# Altium project A PCB Christmas.PrjPcb
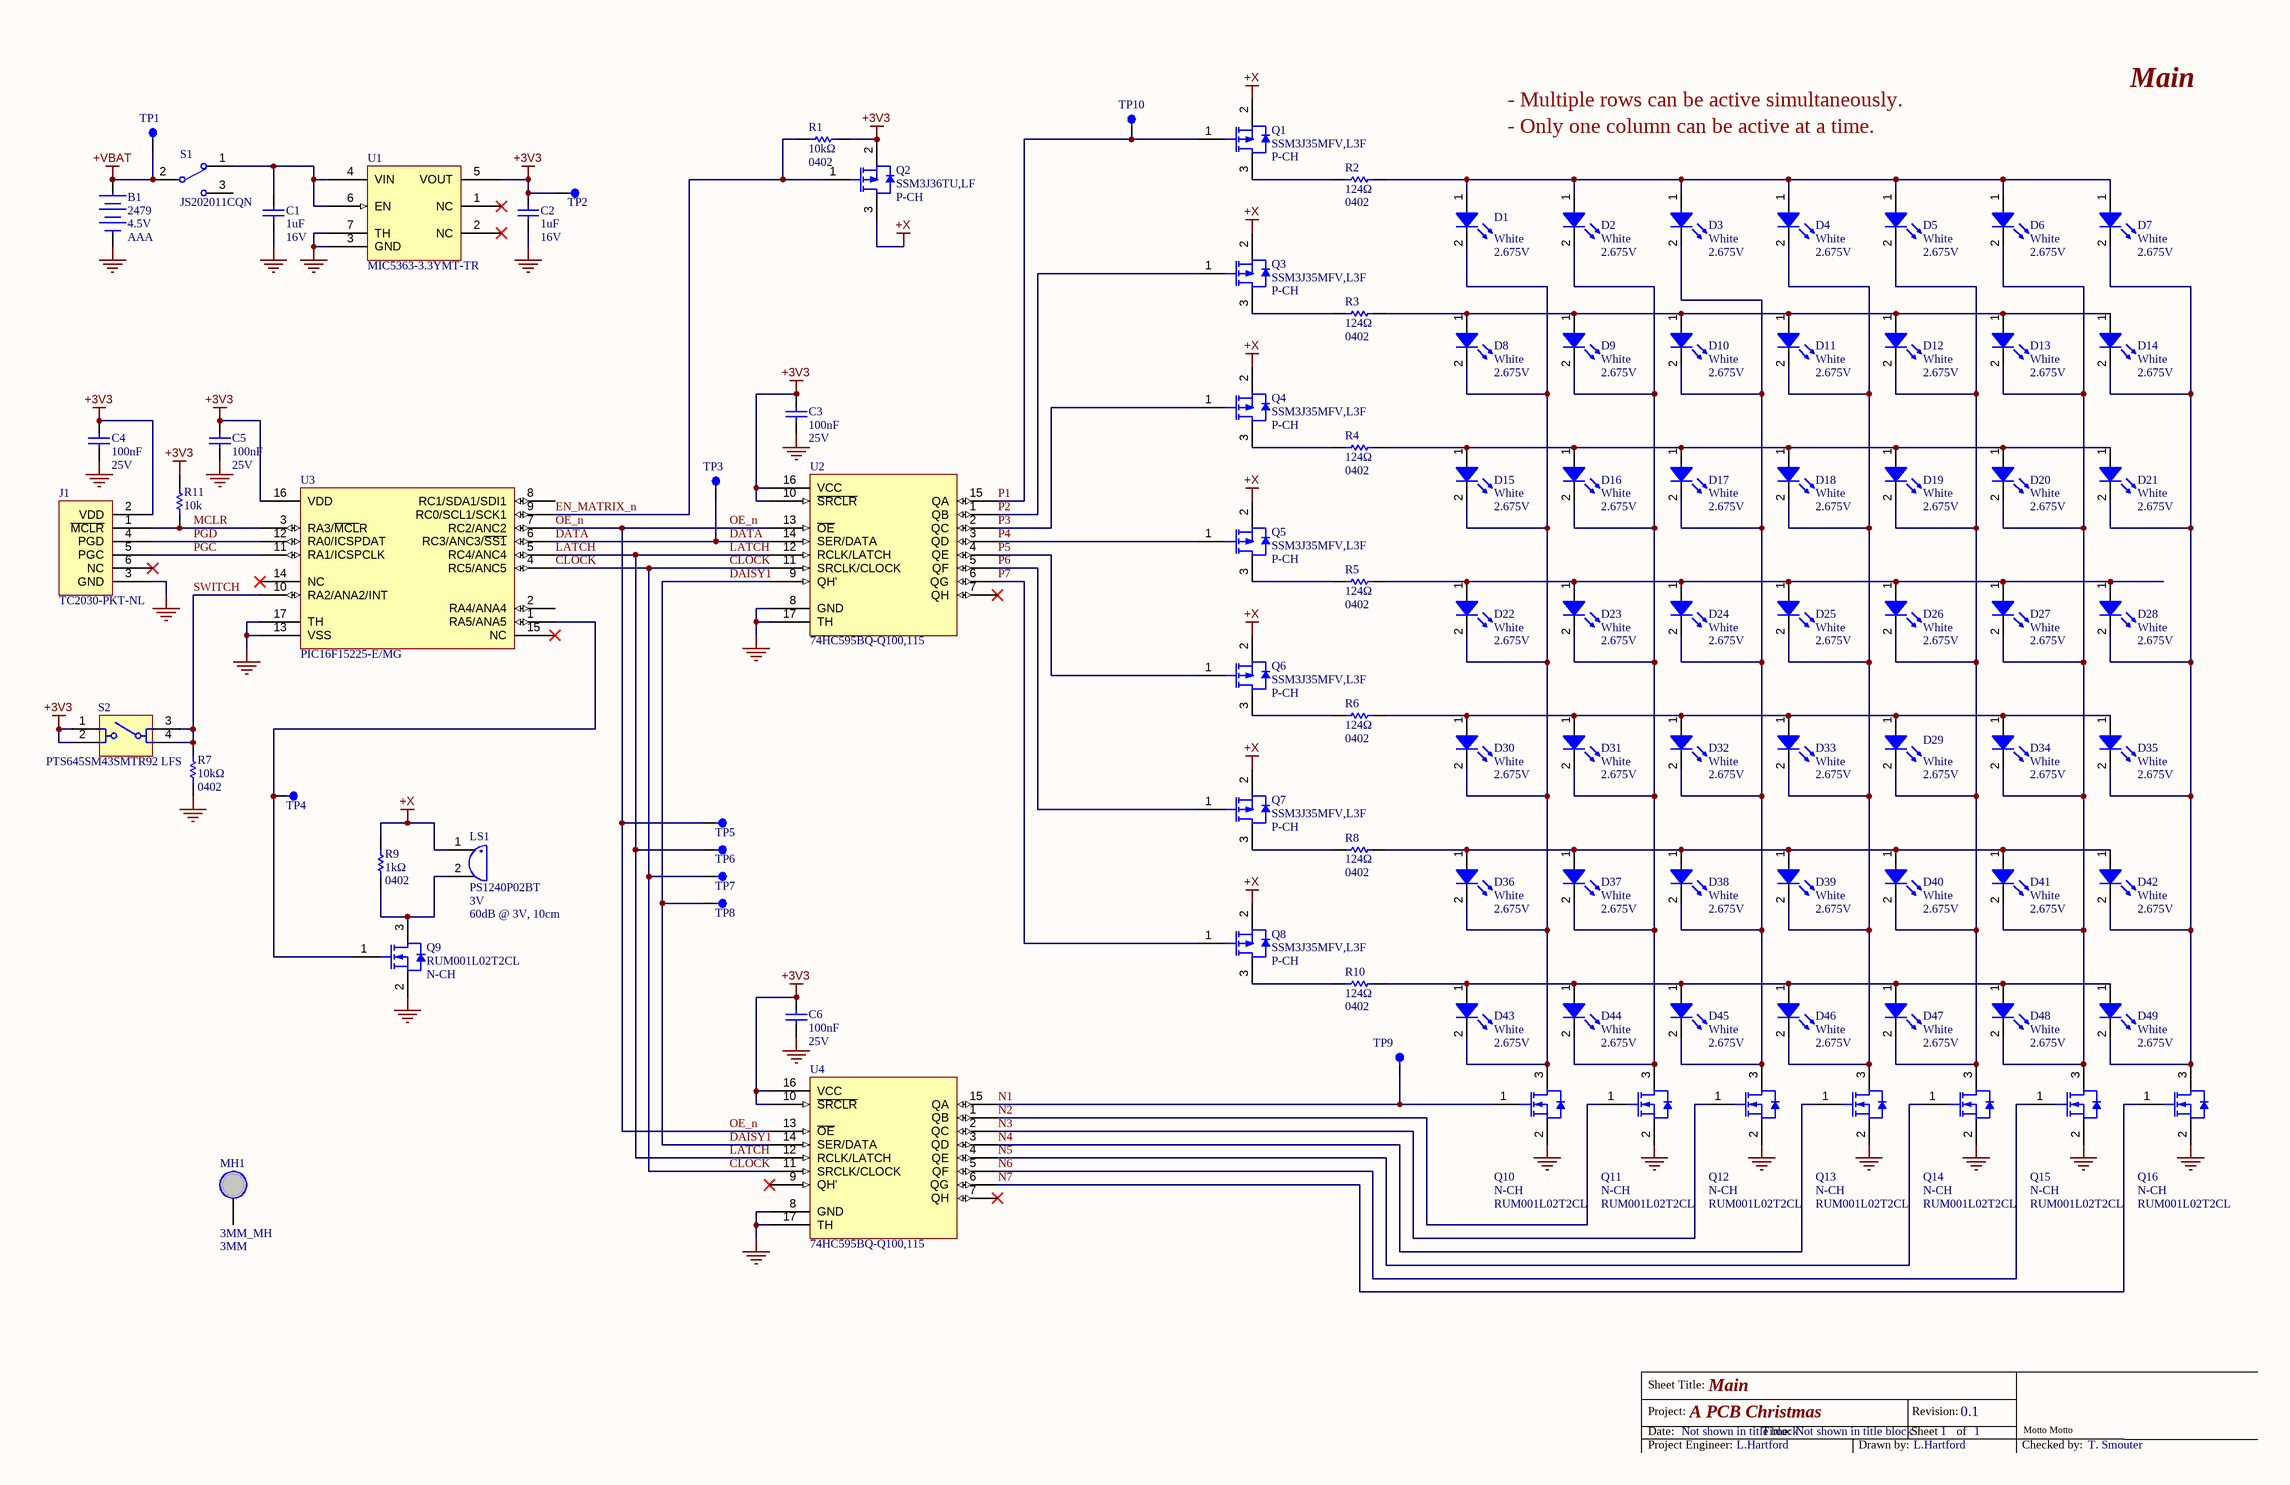
[diagram p0: Main.SchDoc]
EMR_Address: Motto Motto; EMR_Checked_By: T. Smouter; EMR_Copyright_Year: 2021; EMR_Customer: Internal; EMR_Drawn_By: L.Hartford; EMR_Project_Engineer: L.Hartford; EMR_Project_Title: A PCB Christmas; EMR_Revision: 0.1
1 sheet, 102 parts. Net scope: global (net labels, ports and power ports of the same name join across sheets).
Board file: A PCB Christmas.PcbDoc

## Sheet Main.SchDoc: Main
size 431 x 279 mm; Date: Not shown in title block; ApprovedBy: Not shown in title block; CheckedBy: Not shown in title block; Author: Not shown in title block; CompanyName: Not shown in title block; Engineer: Not shown in title block; Organization: EMR Laboratories Inc; Address1: 420 Downsview Pl; Address2: Waterloo, ON; Address3: N2K 3T9; Address4: Canada; Revision: 0.1; PageSetup: Record=PageOptions|CenterHorizontal=True|CenterVertical=True|PrintScale=1.00|XCorrection=1.00|YCorrection=1.00|PrintKind=0|BorderSize=5000000|LeftOffset=0|BottomOffset=0|Orientation=2|PaperLength=1000|PaperWidth=1000|Scale=100|PaperSource=15|PrintQuality=600|MediaType=1|DitherType=10|PaperKind=Letter|PrintScaleMode=1; DocumentNumber: 1; SheetNumber: 1; SheetTotal: 1; CurrentTime: Not shown in title block; CurrentDate: Not shown in title block; Time: Not shown in title block; DocumentFullPathAndName: Not shown in title block; DocumentName: Not shown in title block; ModifiedDate: Not shown in title block; ImagePath: Not shown in title block

### Parts
B1  V: 4.5V  Series: AAA  [2479]  (hidden comment: Three Cell)
C1  value 1uF  Voltage: 16V  [C0402]  (hidden comment: Ceramic Cap)
C2  value 1uF  Voltage: 16V  [C0402]  (hidden comment: Ceramic Cap)
C3  value 100nF  Voltage: 25V  [C0402]  (hidden comment: Ceramic Cap)
C4  value 100nF  Voltage: 25V  [C0402]  (hidden comment: Ceramic Cap)
C5  value 100nF  Voltage: 25V  [C0402]  (hidden comment: Ceramic Cap)
C6  value 100nF  Voltage: 25V  [C0402]  (hidden comment: Ceramic Cap)
D1  Color: White  Forward: 2.675V  [16-219AUTD/S3151/TR8]  (hidden comment: LED)
D2  Color: White  Forward: 2.675V  [16-219AUTD/S3151/TR8]  (hidden comment: LED)
D3  Color: White  Forward: 2.675V  [16-219AUTD/S3151/TR8]  (hidden comment: LED)
D4  Color: White  Forward: 2.675V  [16-219AUTD/S3151/TR8]  (hidden comment: LED)
D5  Color: White  Forward: 2.675V  [16-219AUTD/S3151/TR8]  (hidden comment: LED)
D6  Color: White  Forward: 2.675V  [16-219AUTD/S3151/TR8]  (hidden comment: LED)
D7  Color: White  Forward: 2.675V  [16-219AUTD/S3151/TR8]  (hidden comment: LED)
D8  Color: White  Forward: 2.675V  [16-219AUTD/S3151/TR8]  (hidden comment: LED)
D9  Color: White  Forward: 2.675V  [16-219AUTD/S3151/TR8]  (hidden comment: LED)
D10  Color: White  Forward: 2.675V  [16-219AUTD/S3151/TR8]  (hidden comment: LED)
D11  Color: White  Forward: 2.675V  [16-219AUTD/S3151/TR8]  (hidden comment: LED)
D12  Color: White  Forward: 2.675V  [16-219AUTD/S3151/TR8]  (hidden comment: LED)
D13  Color: White  Forward: 2.675V  [16-219AUTD/S3151/TR8]  (hidden comment: LED)
D14  Color: White  Forward: 2.675V  [16-219AUTD/S3151/TR8]  (hidden comment: LED)
D15  Color: White  Forward: 2.675V  [16-219AUTD/S3151/TR8]  (hidden comment: LED)
D16  Color: White  Forward: 2.675V  [16-219AUTD/S3151/TR8]  (hidden comment: LED)
D17  Color: White  Forward: 2.675V  [16-219AUTD/S3151/TR8]  (hidden comment: LED)
D18  Color: White  Forward: 2.675V  [16-219AUTD/S3151/TR8]  (hidden comment: LED)
D19  Color: White  Forward: 2.675V  [16-219AUTD/S3151/TR8]  (hidden comment: LED)
D20  Color: White  Forward: 2.675V  [16-219AUTD/S3151/TR8]  (hidden comment: LED)
D21  Color: White  Forward: 2.675V  [16-219AUTD/S3151/TR8]  (hidden comment: LED)
D22  Color: White  Forward: 2.675V  [16-219AUTD/S3151/TR8]  (hidden comment: LED)
D23  Color: White  Forward: 2.675V  [16-219AUTD/S3151/TR8]  (hidden comment: LED)
D24  Color: White  Forward: 2.675V  [16-219AUTD/S3151/TR8]  (hidden comment: LED)
D25  Color: White  Forward: 2.675V  [16-219AUTD/S3151/TR8]  (hidden comment: LED)
D26  Color: White  Forward: 2.675V  [16-219AUTD/S3151/TR8]  (hidden comment: LED)
D27  Color: White  Forward: 2.675V  [16-219AUTD/S3151/TR8]  (hidden comment: LED)
D28  Color: White  Forward: 2.675V  [16-219AUTD/S3151/TR8]  (hidden comment: LED)
D29  Color: White  Forward: 2.675V  [16-219AUTD/S3151/TR8]  (hidden comment: LED)
D30  Color: White  Forward: 2.675V  [16-219AUTD/S3151/TR8]  (hidden comment: LED)
D31  Color: White  Forward: 2.675V  [16-219AUTD/S3151/TR8]  (hidden comment: LED)
D32  Color: White  Forward: 2.675V  [16-219AUTD/S3151/TR8]  (hidden comment: LED)
D33  Color: White  Forward: 2.675V  [16-219AUTD/S3151/TR8]  (hidden comment: LED)
D34  Color: White  Forward: 2.675V  [16-219AUTD/S3151/TR8]  (hidden comment: LED)
D35  Color: White  Forward: 2.675V  [16-219AUTD/S3151/TR8]  (hidden comment: LED)
D36  Color: White  Forward: 2.675V  [16-219AUTD/S3151/TR8]  (hidden comment: LED)
D37  Color: White  Forward: 2.675V  [16-219AUTD/S3151/TR8]  (hidden comment: LED)
D38  Color: White  Forward: 2.675V  [16-219AUTD/S3151/TR8]  (hidden comment: LED)
D39  Color: White  Forward: 2.675V  [16-219AUTD/S3151/TR8]  (hidden comment: LED)
D40  Color: White  Forward: 2.675V  [16-219AUTD/S3151/TR8]  (hidden comment: LED)
D41  Color: White  Forward: 2.675V  [16-219AUTD/S3151/TR8]  (hidden comment: LED)
D42  Color: White  Forward: 2.675V  [16-219AUTD/S3151/TR8]  (hidden comment: LED)
D43  Color: White  Forward: 2.675V  [16-219AUTD/S3151/TR8]  (hidden comment: LED)
D44  Color: White  Forward: 2.675V  [16-219AUTD/S3151/TR8]  (hidden comment: LED)
D45  Color: White  Forward: 2.675V  [16-219AUTD/S3151/TR8]  (hidden comment: LED)
D46  Color: White  Forward: 2.675V  [16-219AUTD/S3151/TR8]  (hidden comment: LED)
D47  Color: White  Forward: 2.675V  [16-219AUTD/S3151/TR8]  (hidden comment: LED)
D48  Color: White  Forward: 2.675V  [16-219AUTD/S3151/TR8]  (hidden comment: LED)
D49  Color: White  Forward: 2.675V  [16-219AUTD/S3151/TR8]  (hidden comment: LED)
J1  TC2030-PKT-NL  [TC2030-PKT-NL]
LS1  Voltage: 3V  Sound Pressure Level: 60dB @ 3V, 10cm  [PS1240P02BT]  (hidden comment: Buzzer)
MH1  3MM_MH  Size: 3MM  [3MM_MH]
Q1  Manufacturer Part Number: SSM3J35MFV,L3F  [SOTFL40P120X55-3N-2]  (hidden comment: P-CH)
Q2  Manufacturer Part Number: SSM3J36TU,LF  [SOTFL65P210X75-3N]  (hidden comment: P-CH)
Q3  Manufacturer Part Number: SSM3J35MFV,L3F  [SOTFL40P120X55-3N-2]  (hidden comment: P-CH)
Q4  Manufacturer Part Number: SSM3J35MFV,L3F  [SOTFL40P120X55-3N-2]  (hidden comment: P-CH)
Q5  Manufacturer Part Number: SSM3J35MFV,L3F  [SOTFL40P120X55-3N-2]  (hidden comment: P-CH)
Q6  Manufacturer Part Number: SSM3J35MFV,L3F  [SOTFL40P120X55-3N-2]  (hidden comment: P-CH)
Q7  Manufacturer Part Number: SSM3J35MFV,L3F  [SOTFL40P120X55-3N-2]  (hidden comment: P-CH)
Q8  Manufacturer Part Number: SSM3J35MFV,L3F  [SOTFL40P120X55-3N-2]  (hidden comment: P-CH)
Q9  Manufacturer Part Number: RUM001L02T2CL  [SOTFL40P120X55-3N]  (hidden comment: N-CH)
Q10  Manufacturer Part Number: RUM001L02T2CL  [SOTFL40P120X55-3N]  (hidden comment: N-CH)
Q11  Manufacturer Part Number: RUM001L02T2CL  [SOTFL40P120X55-3N]  (hidden comment: N-CH)
Q12  Manufacturer Part Number: RUM001L02T2CL  [SOTFL40P120X55-3N]  (hidden comment: N-CH)
Q13  Manufacturer Part Number: RUM001L02T2CL  [SOTFL40P120X55-3N]  (hidden comment: N-CH)
Q14  Manufacturer Part Number: RUM001L02T2CL  [SOTFL40P120X55-3N]  (hidden comment: N-CH)
Q15  Manufacturer Part Number: RUM001L02T2CL  [SOTFL40P120X55-3N]  (hidden comment: N-CH)
Q16  Manufacturer Part Number: RUM001L02T2CL  [SOTFL40P120X55-3N]  (hidden comment: N-CH)
R1  value 10kΩ  Package/Footprint: 0402  [RESC1005X04N]  (hidden comment: Resistor)
R2  value 124Ω  Package/Footprint: 0402  [RESC1005X04N]  (hidden comment: Resistor)
R3  value 124Ω  Package/Footprint: 0402  [RESC1005X04N]  (hidden comment: Resistor)
R4  value 124Ω  Package/Footprint: 0402  [RESC1005X04N]  (hidden comment: Resistor)
R5  value 124Ω  Package/Footprint: 0402  [RESC1005X04N]  (hidden comment: Resistor)
R6  value 124Ω  Package/Footprint: 0402  [RESC1005X04N]  (hidden comment: Resistor)
R7  value 10kΩ  Package/Footprint: 0402  [RESC1005X04N]  (hidden comment: Resistor)
R8  value 124Ω  Package/Footprint: 0402  [RESC1005X04N]  (hidden comment: Resistor)
R9  value 1kΩ  Package/Footprint: 0402  [RESC1005X04N]  (hidden comment: Resistor)
R10  value 124Ω  Package/Footprint: 0402  [RESC1005X04N]  (hidden comment: Resistor)
R11  10k  [RESC1005X04N]
S1  JS202011CQN  [JS202011CQN]
S2  PTS645SM43SMTR92 LFS  [PTS645SM43SMTR92 LFS]
TP1  TP  [ORNAMENTS]  (value not drawn)
TP2  TP  [ORNAMENTS]  (value not drawn)
TP3  TP  [ORNAMENTS]  (value not drawn)
TP4  TP  [ORNAMENTS]  (value not drawn)
TP5  TP  [ORNAMENTS]  (value not drawn)
TP6  TP  [ORNAMENTS]  (value not drawn)
TP7  TP  [ORNAMENTS]  (value not drawn)
TP8  TP  [ORNAMENTS]  (value not drawn)
TP9  TP  [ORNAMENTS]  (value not drawn)
TP10  TP  [ORNAMENTS]  (value not drawn)
U1  MIC5363-3.3YMT-TR  [QFN40P120X120X60_HS-7N]
U2  74HC595BQ-Q100,115  [QFN50P250X350X100_HS-17N]
U3  PIC16F15225-E/MG  [PQFN50P300X300X90_HS-17N]
U4  74HC595BQ-Q100,115  [QFN50P250X350X100_HS-17N]

### Nets
+3V3: C2.2 C3.2 C4.2 C5.2 C6.2 J1.2(VDD) Q2.2(S) R1.2 R11.2 S2.1 S2.2 TP2.1(A) U1.5(VOUT) U2.10(~{SRCLR}) U2.16(VCC) U3.16(VDD) U4.10(~{SRCLR}) U4.16(VCC)
+VBAT: B1.1(+) S1.2 TP1.1(A)
+X: LS1.1(+) Q1.2(S) Q2.3(D) Q3.2(S) Q4.2(S) Q5.2(S) Q6.2(S) Q7.2(S) Q8.2(S) R9.2
GND: B1.2(-) C1.1 C2.1 C3.1 C4.1 C5.1 C6.1 J1.3(GND) Q9.2(S) Q10.2(S) Q11.2(S) Q12.2(S) Q13.2(S) Q14.2(S) Q15.2(S) Q16.2(S) R7.1 U1.3(GND) U1.7(TH) U2.8(GND) U2.17(TH) U3.13(VSS) U3.17(TH) U4.8(GND) U4.17(TH)
CLOCK: TP7.1(A) U2.11(SRCLK/CLOCK) U3.4(RC5/ANC5) U4.11(SRCLK/CLOCK)
DAISY1: TP8.1(A) U2.9(QH') U4.14(SER/DATA)
DATA: TP3.1(A) U2.14(SER/DATA) U3.6(RC3/ANC3/~{SS1})
EN_MATRIX_n: Q2.1(G) R1.1 U3.9(RC0/SCL1/SCK1)
LATCH: TP6.1(A) U2.12(RCLK/LATCH) U3.5(RC4/ANC4) U4.12(RCLK/LATCH)
MCLR: J1.1(~{MCLR}) R11.1 U3.3(RA3/~{MCL}R)
N1: Q10.1(G) TP9.1(A) U4.15(QA)
N2: Q11.1(G) U4.1(QB)
N3: Q12.1(G) U4.2(QC)
N4: Q13.1(G) U4.3(QD)
N5: Q14.1(G) U4.4(QE)
N6: Q15.1(G) U4.5(QF)
N7: Q16.1(G) U4.6(QG)
OE_n: TP5.1(A) U2.13(~{OE}) U3.7(RC2/ANC2) U4.13(~{OE})
P1: Q1.1(G) TP10.1(A) U2.15(QA)
P2: Q3.1(G) U2.1(QB)
P3: Q4.1(G) U2.2(QC)
P4: Q5.1(G) U2.3(QD)
P5: Q6.1(G) U2.4(QE)
P6: Q7.1(G) U2.5(QF)
P7: Q8.1(G) U2.6(QG)
PGC: J1.5(PGC) U3.11(RA1/ICSPCLK)
PGD: J1.4(PGD) U3.12(RA0/ICSPDAT)
SWITCH: R7.2 S2.3 S2.4 U3.10(RA2/ANA2/INT)
NetC1_2: C1.2 S1.1 U1.4(VIN) U1.6(EN)
NetD1_1: D1.1(A) D2.1(A) D3.1(A) D4.1(A) D5.1(A) D6.1(A) D7.1(A) R2.2
NetD1_2: D1.2(K) D8.2(K) D15.2(K) D22.2(K) D30.2(K) D36.2(K) D43.2(K) Q10.3(D)
NetD2_2: D2.2(K) D9.2(K) D16.2(K) D23.2(K) D31.2(K) D37.2(K) D44.2(K) Q11.3(D)
NetD3_2: D3.2(K) D10.2(K) D17.2(K) D24.2(K) D32.2(K) D38.2(K) D45.2(K) Q12.3(D)
NetD4_2: D4.2(K) D11.2(K) D18.2(K) D25.2(K) D33.2(K) D39.2(K) D46.2(K) Q13.3(D)
NetD5_2: D5.2(K) D12.2(K) D19.2(K) D26.2(K) D29.2(K) D40.2(K) D47.2(K) Q14.3(D)
NetD6_2: D6.2(K) D13.2(K) D20.2(K) D27.2(K) D34.2(K) D41.2(K) D48.2(K) Q15.3(D)
NetD7_2: D7.2(K) D14.2(K) D21.2(K) D28.2(K) D35.2(K) D42.2(K) D49.2(K) Q16.3(D)
NetD8_1: D8.1(A) D9.1(A) D10.1(A) D11.1(A) D12.1(A) D13.1(A) D14.1(A) R3.2
NetD15_1: D15.1(A) D16.1(A) D17.1(A) D18.1(A) D19.1(A) D20.1(A) D21.1(A) R4.2
NetD22_1: D22.1(A) D23.1(A) D24.1(A) D25.1(A) D26.1(A) D27.1(A) D28.1(A) R5.2
NetD29_1: D29.1(A) D30.1(A) D31.1(A) D32.1(A) D33.1(A) D34.1(A) D35.1(A) R6.2
NetD36_1: D36.1(A) D37.1(A) D38.1(A) D39.1(A) D40.1(A) D41.1(A) D42.1(A) R8.2
NetD43_1: D43.1(A) D44.1(A) D45.1(A) D46.1(A) D47.1(A) D48.1(A) D49.1(A) R10.2
NetLS1_2: LS1.2(-) Q9.3(D) R9.1
NetQ1_3: Q1.3(D) R2.1
NetQ3_3: Q3.3(D) R3.1
NetQ4_3: Q4.3(D) R4.1
NetQ5_3: Q5.3(D) R5.1
NetQ6_3: Q6.3(D) R6.1
NetQ7_3: Q7.3(D) R8.1
NetQ8_3: Q8.3(D) R10.1
NetQ9_1: Q9.1(G) TP4.1(A) U3.1(RA5/ANA5)

Not connected (* = marked no-connect by the designer): J1 6(NC)*; MH1 1; S1 3; U1 1(NC)* 2(NC)*; U2 7(QH)*; U3 2(RA4/ANA4) 8(RC1/SDA1/SDI1) 14(NC)* 15(NC)*; U4 7(QH)* 9(QH')*

### Notes on the sheet
- - Multiple rows can be active simultaneously.
- - Only one column can be active at a time.
- Sheet Title:
- Date:
- Project:
- Time:
- Sheet
- Revision:
- of
- Project Engineer:
- Drawn by:
- Checked by:

### Library data of the parts
B1 = 2479: Cells: 3; =Manufacturer Part Number: 2479; Part Number: 2479; Battery Series: AAA; Voltage: 4.5V; Supplier: Digi-Key; Supplier Part Number: 36-2479-ND; Mounting Type: TH
C1 C2 = CL05A105KO5NNNC: Manufacturer: Samsung Electro-Mechanics; Part Number: CL05A105KO5NNNC; Package: 0402; Supplier: Digi-Key; Supplier Part Number: 1276-1067-1-ND; Voltage Rating: 16V; Capacitance: 1uF
C3-C6 = CL05A104KA5NNNC: Manufacturer: Samsung Electro-Mechanics; Part Number: CL05A104KA5NNNC; Package: 0402; Supplier: Digi-Key; Supplier Part Number: 1276-1043-1-ND; Voltage Rating: 25V; Capacitance: 100nF
D1-D49 = 16-219AUTD/S3151/TR8: Manufacturer Part Number: 16-219AUTD/S3151/TR8; Part Number: 16-219AUTD/S3151/TR8; Colour: White; Vf: 2.675V; Size: 1.00mm L x 0.50mm W; Supplier Part Number: 1080-1571-1-ND; Mounting Type: SMD
J1 = TC2030-PKT-NL: No Clip 6 Pin Tag Connect; Manufacturer: Tag-Connect LLC; Part Number: TC2030-PKT-NL; Mounting Type: SM; Supplier: Digi-Key; Supplier Part Number: Tag-Connect LLC
LS1 = PS1240P02BT: V Max: 30V; Input Type: Zero-Peak Signal; Driver Circuitry: Transducer, Externally Driven; Manufacturer Part Number: PS1240P02BT; Part Number: PS1240P02BT; V Rated: 3V; SPL: 60dB @ 3V, 10cm; Mounting Type: TH; Supplier: Digi-Key; Supplier Part Number: 445-2525-1-ND
Q1 Q3-Q8 = SSM3J35MFV,L3F: Manufacturer: Toshiba Semiconductor and Storage; Vds: 20V; Vgs (Max): 8V; Id: 100mA; FET Type: P-CH; Part Number: SSM3J35MFV,L3F; Type: P-CH; Package: SOT-723; Supplier: Digi-Key; Supplier Part Number: SSM3J35MFVL3FCT-ND
Q2 = SSM3J36TU,LF: Manufacturer: Toshiba Semiconductor and Storage; Vds: 20V; Vgs (Max): 8V; Id: 330mA; FET Type: P-CH; Part Number: SSM3J36TU,LF; Type: P-CH; Package: 3-SMD, Flat Leads; Supplier: Digi-Key; Supplier Part Number: SSM3J36TULFCT-ND
Q9-Q16 = RUM001L02T2CL: Manufacturer: Rohm Semiconductor; Vds: 20V; Vgs (Max): 8V; Id: 100mA; FET Type: N-CH; Part Number: RUM001L02T2CL; Type: N-CH; Package: SOT-723; Supplier: Digi-Key; Supplier Part Number: RUM001L02T2CLCT-ND
R1 R7 = RMCF0402FT10K0: Manufacturer: Stackpole Electronics Inc; Part Number: RMCF0402FT10K0; Supplier: Digi-Key; Supplier Part Number: RMCF0402FT10K0CT-ND; Resistance: 10kΩ; Package: 0402
R2-R6 R8 R10 = ERJ-2RKF1240X: Manufacturer: Panasonic Electronic Components; Part Number: ERJ-2RKF1240X; Supplier: Digi-Key; Supplier Part Number: P124LCT-ND; Resistance: 124Ω; Package: 0402
R9 = RC0402FR-071RL: Manufacturer: Yageo; Part Number: RC0402FR-071RL; Supplier: Digi-Key; Supplier Part Number: 311-1.00LRCT-ND; Resistance: 1kΩ; Package: 0402
R11 = RC0402FR-0710KL: RES SMD 10K OHM 1% 1/16W 0402; Manufacturer: Yageo; Power Rating: 62.5mW; Voltage Rating: 50V; Temperature Coefficient: 100ppm/°C; Part Number: RC0402FR-0710KL; Value: 10k; Supplier 1: Digi-Key; Supplier Part Number 1: 311-10.0KLRCT-ND; Manufacturer Part Number: RC0402FR-0710KL; Stock 1: 14034353; Pricing 1: 1=0.1, 10=0.014, 100=0.0056, 1000=0.0025, 2500=0.0022, 5000=0.0018 (USD); Case/Package: 0402; Case Code (Metric): 1005; Case Code (Imperial): 0402; Min Operating Temperature: -55°C; Max Operating Temperature: 155°C; Packaging: Tape and Reel; Tolerance: 1%; Composition: Thick Film; Resistance: 10k; Military Standard: Not; Length: 1mm; Height: 0.32mm; Width: 0.5mm; Depth: 0.5mm; Lead Pitch: 0.2mm; REACH SVHC: No SVHC; Lead Free: Lead Free
S1 = JS202011CQN: Function: Slide Switch; Mouting Type: TH; Manufacturer Part Number: JS202011CQN; Part Number: JS202011CQN; Supplier: Digi-Key; Supplier Part Number: 401-2001-ND
S2 = PTS645SK50SMTR92LFS: SWITCH TACTILE SPST-NO 0.05A 12V; Manufacturer: ITT /  C&K Components; Current Rating: 50mA; Mechanical Life: 100000Cycles; Actuator Material: Nylon,Polyamide; Throw Configuration: SPST; Operating Force: 160gf; Contact Resistance: 100mR; Illumination Type: Non-Illuminated,Illuminated; Actuator Length: 0.85mm; Function: Tactile Switch; Mouting Type: SM; Part Number: PTS645SK50SMTR92LFS; ComponentLink1Description: https://datasheet.ciiva.com/29903/getdatasheetpartid-786341-29903846.pdf; ComponentLink1URL: https://datasheet.ciiva.com/29903/getdatasheetpartid-786341-29903846.pdf; ComponentLink2Description: https://datasheet.ciiva.com/14920/pts645-14920733.pdf; ComponentLink2URL: https://datasheet.ciiva.com/14920/pts645-14920733.pdf; Supplier 1: Digikey; Supplier Part Number 1: CKN9112CT-ND; Manufacturer Part Number: PTS645SM43SMTR92LFS; Stock 1: 442768; Pricing 1: 1=0.15, 10=0.147, 25=0.1416, 50=0.1366, 100=0.129, 250=0.1214, 500=0.1164 (USD); Case/Package: SMD/SMT; Min Operating Temperature: -20°C; Max Operating Temperature: 60°C; Packaging: Tape and Reel; Package Quantity: 1000; Termination: Gull Wing; Length: 6mm; Depth: 9mm; REACH SVHC: No SVHC; Lead Free: Lead Free; ComponentLink3URL: https://datasheet.ciiva.com/14920/pts645-14920734.pdf; ComponentLink3Description: https://datasheet.ciiva.com/14920/pts645-14920734.pdf; Mount: Surface Mount; Contact Plating: Silver; Contact Material: Silver; Colour: Black; Max Voltage Rating (DC): 12V; Max Current Rating: 50mA; Voltage Rating (DC): 12V; Orientation: Straight; ComponentLink4URL: https://datasheet.ciiva.com/14920/pts645-14920735.pdf; ComponentLink4Description: https://datasheet.ciiva.com/14920/pts645-14920735.pdf; ComponentLink5URL: https://datasheet.ciiva.com/29931/getdatasheetpartid-764615-29931183.pdf; ComponentLink5Description: https://datasheet.ciiva.com/29931/getdatasheetpartid-764615-29931183.pdf; Supplier: Digi-Key; Supplier Part Number: CKN9087CT-ND
TP1-TP10 = ORNAMENTS: Part Number: ORNAMENTS
U1 = MIC5363-3.3YMT-TR: Manufacturer: Microchip Technology; Part Number: MIC5363-3.3YMT-TR; Package: 6-UFDFN Exposed Pad; Supplier: Digi-Key; Supplier Part Number: 576-4133-1-ND
U2 U4 = 74HC595BQ-Q100,115: Manufacturer: Nexperia USA Inc.; Manufacturer Part Number: 74HC595BQ-Q100,115; Part Number: 74HC595BQ-Q100,115; Package: 16-VFQFN Exposed Pad; Supplier: Digi-Key; Supplier Part Number: 1727-2622-1-ND
U3 = PIC16F15225-E/MG: Manufacturer: Microchip Technology; Manufacturer Part Number: PIC16F15225-E/MG; Part Number: PIC16F15225-E/MG; Package: 16-VFQFN Exposed Pad; Supplier: Digi-Key; Supplier Part Number: 150-PIC16F15225-E/MG-ND
MH1 = 3MM_MH: Part Number: 3MM_MH; Function: 3MM

## Assembly variants
01: all parts fitted